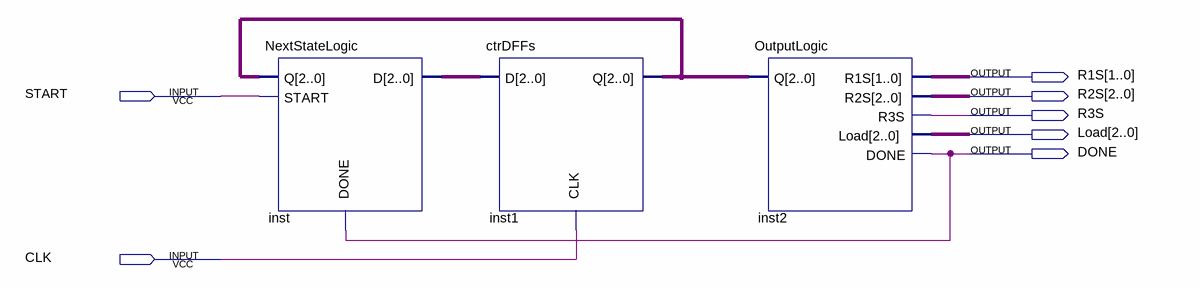
[diagram p0: schematic sheet]
// Quartus schematic Controller.bdf as structural Verilog: 3 symbols, 7 pins
module Controller (
  input  START,
  input  CLK,
  output [1:0] R1S,
  output [2:0] R2S,
  output R3S,
  output [2:0] Load,
  output DONE
);

  wire [2:0] inst1_q, inst_d;

  NextStateLogic inst (.Q(inst1_q), .START(START), .DONE(DONE), .D(inst_d));
  ctrDFFs inst1 (.D(inst_d), .CLK(CLK), .Q(inst1_q));
  OutputLogic inst2 (.Q(inst1_q), .R1S(R1S), .R2S(R2S), .R3S(R3S), .Load(Load), .DONE(DONE));
endmodule
